# EAGLE design bondibarWirelessDongle (EAGLE 7.4.0)
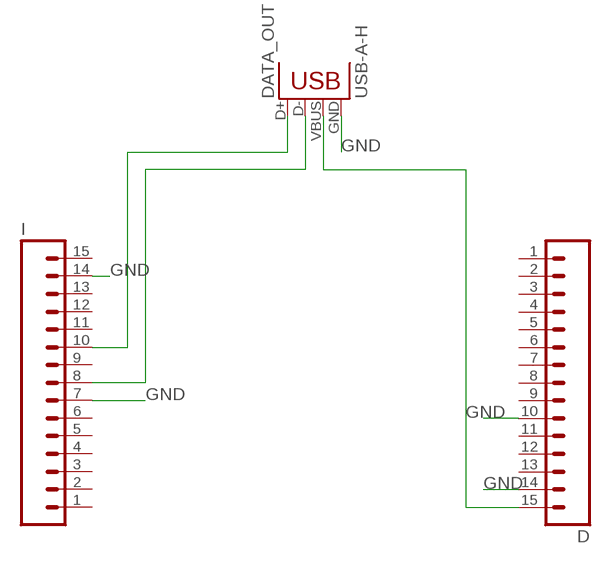
[diagram p0: schematic, sheet 1]

## Parts
D  M15  [1X15]
DATA_OUT  USB-A-H  [USB-A-H]
I  M15  [1X15]

## Nets
GND: D.10 D.14 DATA_OUT.GND I.7 I.14
N$2: D.15 DATA_OUT.VBUS
N$3: DATA_OUT.D+ I.10
N$4: DATA_OUT.D- I.8
Unconnected: D.1 D.2 D.3 D.4 D.5 D.6 D.7 D.8 D.9 D.11 D.12 D.13 I.1 I.2 I.3 I.4 I.5 I.6 I.9 I.11 I.12 I.13 I.15

## Library data of the parts
D I = SparkFun-Connectors:M15: Header 15 Standard 15-pin 0.1" header. Use with straight break away headers (SKU : PRT-00116), right angle break away headers (PRT-00553), swiss pins (PRT-00743), machine pins (PRT-00117), and female headers (PRT-00115).
DATA_OUT = SparkFun-Connectors:USB: USB Connectors USB-B-PTH is fully proven SKU : PRT-00139/CONN-08278 USB-miniB is fully proven SKU : PRT-00587 USB-A-PCB is untested. USB-A-H is throughly reviewed, but untested. Spark Fun Electronics SKU : PRT-00437 USB-B-SMT is throughly reviewed, but untested. Needs silkscreen touching up. USB-A-S has not been used/tested USB-MB-H has not been used/tested USB-MICROB has been used. CONN-09505; PROD_ID: CONN-08367

## Board
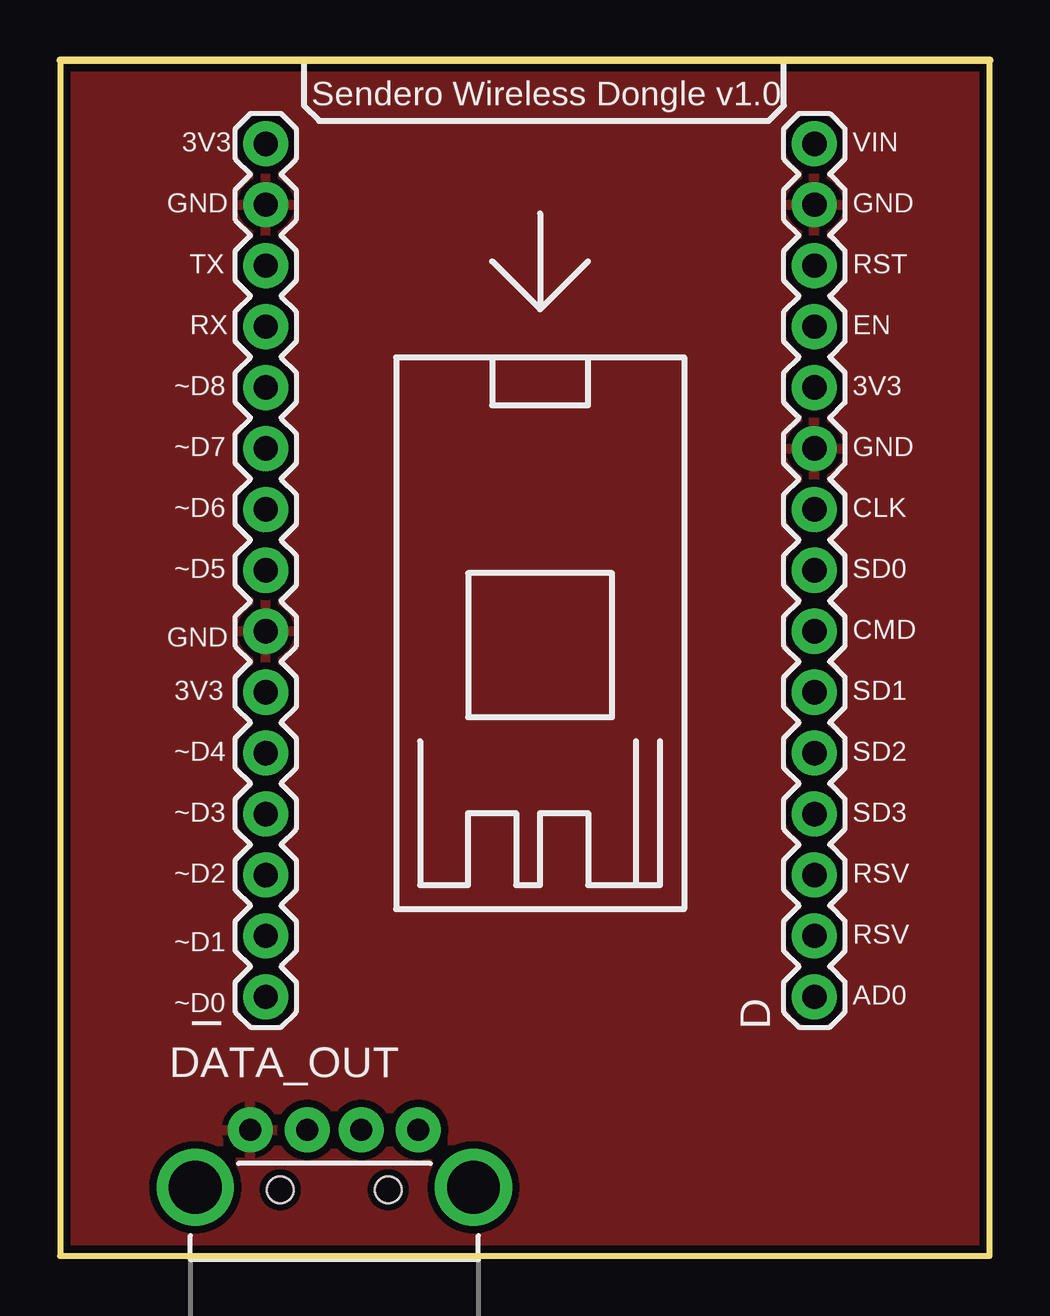
[diagram p1: board, top side]
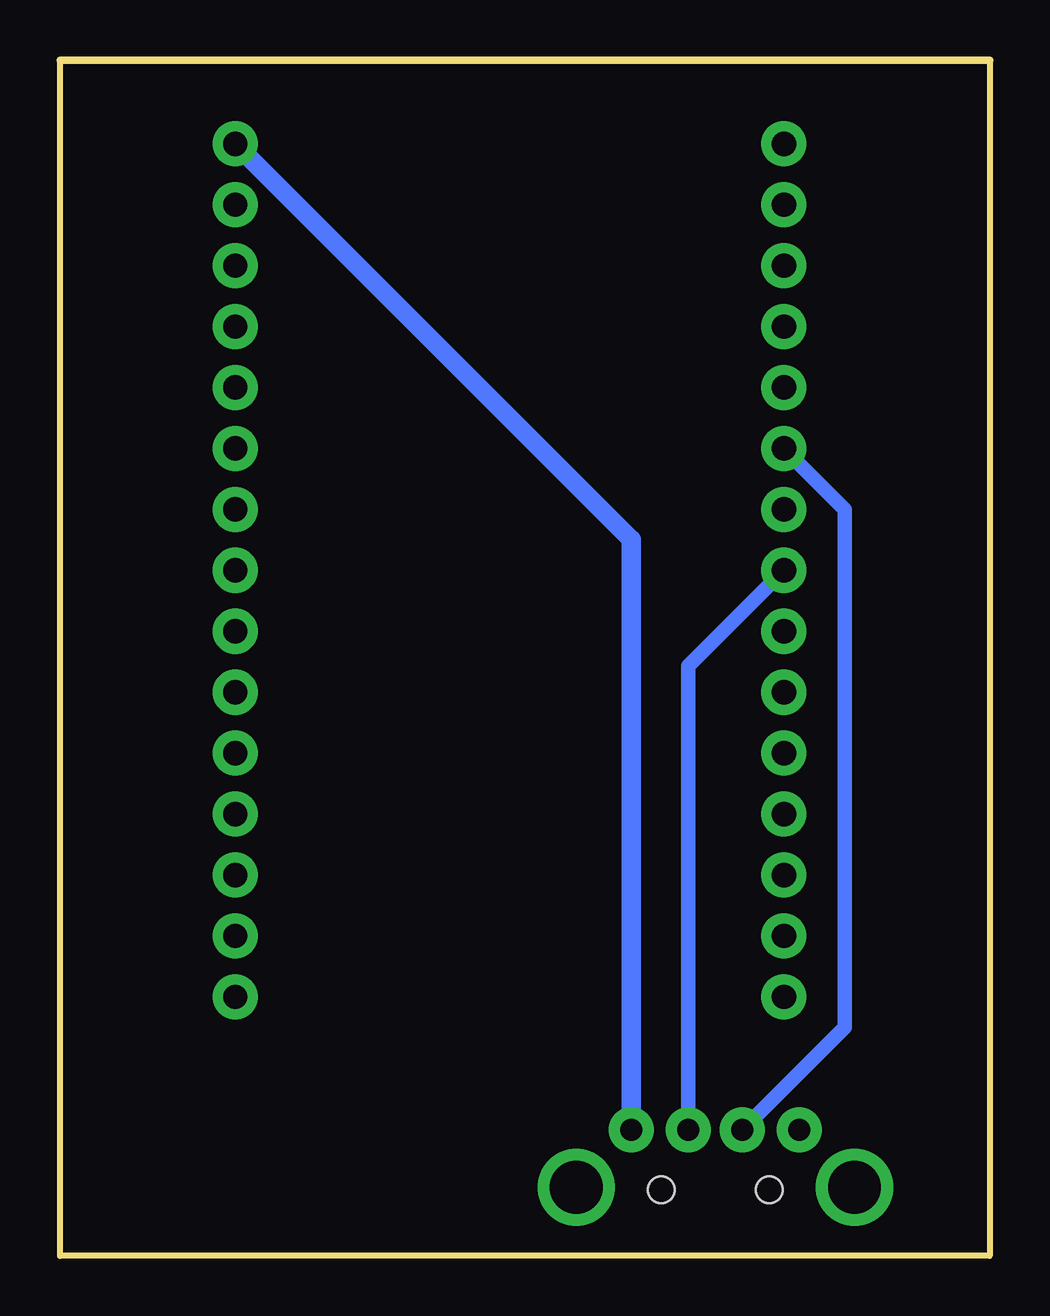
[diagram p2: board, bottom side, seen from below]

Size 38.73 x 49.85 mm. Coordinates in mm from the lower left corner, seen from the top.
Outline: 0,0 38.73,0 38.73,49.85 0,49.85 0,0
Copper layers (1*16): Top 0.035mm / dielectric 1.5mm / Bottom 0.035mm
Design rules "Fusion_eagle_rule_v1.1": minimum track width 6mil, minimum drill 12mil, track to track 6mil, track to pad 6mil, pad to pad 6mil, via to via 6mil, smd to smd 0mil, copper to edge 10mil, drill to drill 10mil, minimum pad ring 10mil, minimum via ring 6mil, stop-mask expansion 2mil, vias tented up to drill 100mil, thermal gap 10mil

### Footprints (pad centres in the part's own frame; a part is rotated, then mirrored left to right if it is on the bottom)
1X15 = drill 1.016 pad 1.88: 1 0,0; 2 2.54,0; 3 5.08,0; 4 7.62,0; 5 10.16,0; 6 12.7,0; 7 15.24,0; 8 17.78,0; 9 20.32,0; 10 22.86,0; 11 25.4,0; 12 27.94,0; 13 30.48,0; 14 33.02,0; 15 35.56,0
USB-A-H = drill 0.914 pad 1.88: D+ 2.4,1.127; D- 2.4,-1.127; GND 2.4,3.5; VBUS 2.4,-3.5 | drill 2.2: GND2 0,-5.8; GND3 0,5.8 | hole 1.1: -0.1,2.25; -0.1,-2.25

### Placement (x,y rotation side)
D  31.43,10.79 90 top
DATA_OUT  11.43,2.86 90 top
I  8.57,10.79 90 top

### Tracks (layer width: path | path; a pad name or v marks a point on that pad's centre or on a via)
GND
  pour Top (isolate 0.305): 0,0 0,49.85 38.73,49.85 38.73,0
N$2
  Bottom 0.61: 31.43,46.46 D.15
  Bottom 0.813: DATA_OUT.VBUS 14.93,29.85 D.15
N$3
  Bottom 0.61: DATA_OUT.D+ 6.03,9.53 6.03,31.11 I.10
N$4
  Bottom 0.61: DATA_OUT.D- 12.56,24.59 I.8

### Text on the board
tPlace: Sendero Wireless Dongle v1.0 | 3V3 | VIN | GND | GND | TX | RST | RX | EN | ~D8 | 3V3 | ~D7 | GND | ~D6 | CLK | ~D5 | SD0 | CMD | GND | 3V3 | SD1 | ~D4 | SD2 | ~D3 | SD3 | ~D2 | RSV | ~D1 | RSV | ~D0 | AD0